# Altium schematic sheet [2]STM32F334R8T6Board_ENC28J60.SchDoc
size B
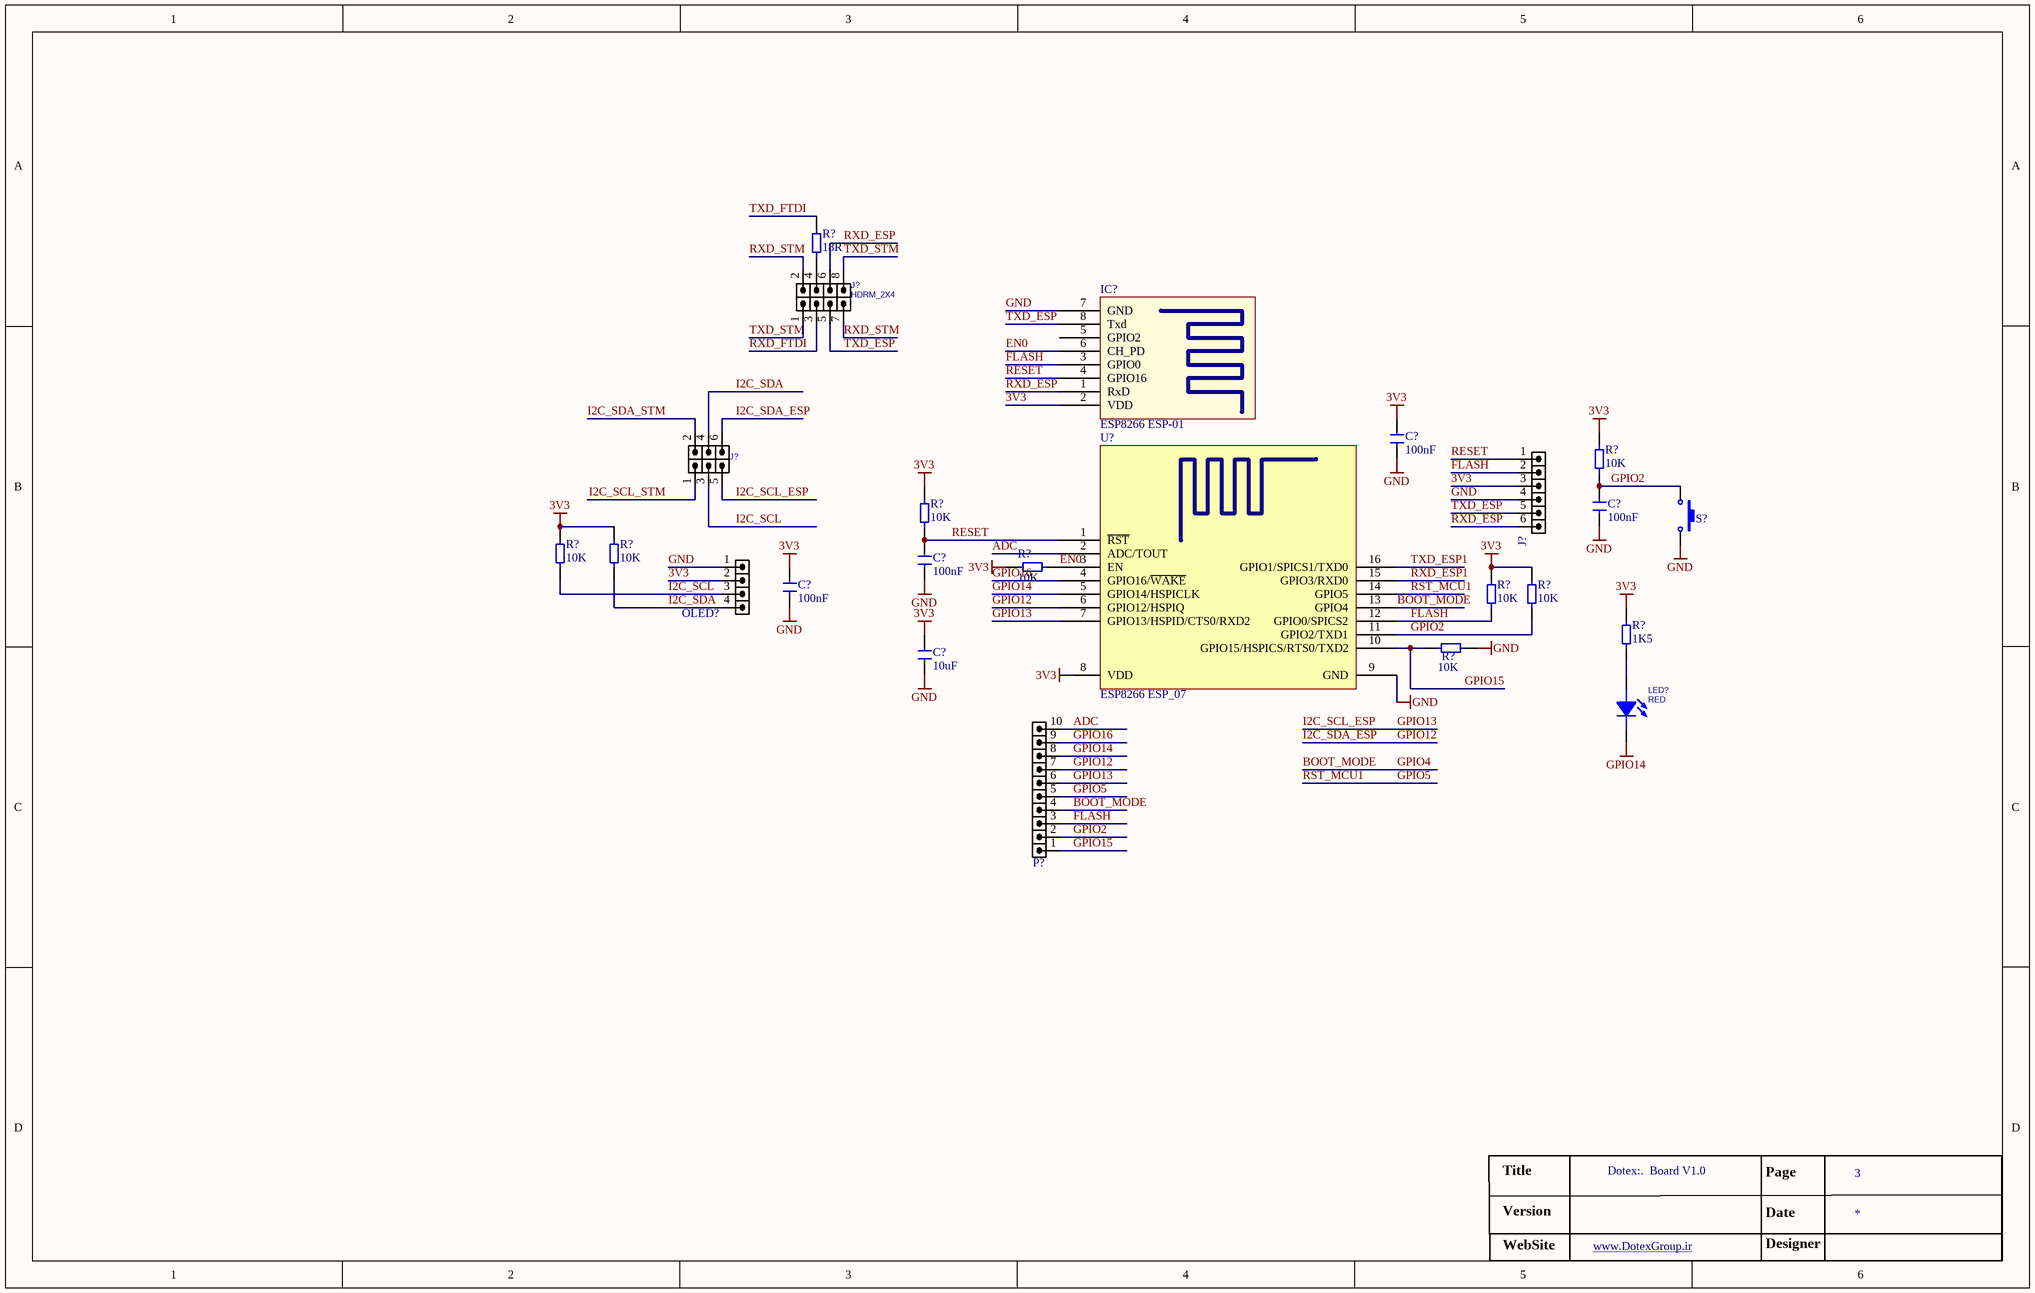
[diagram p0: [2]STM32F334R8T6Board_ENC28J60.SchDoc]

## Parts
(Parts that share a designator on the sheet are numbered #1, #2 ... from top to bottom, then left to right.)
C?#1  Capacitor SMD  [0805 Capacitor]  (value not drawn)
C?#2  Capacitor SMD  [0805 Capacitor]  (value not drawn)
C?#3  Capacitor SMD  [0805 Capacitor]  (value not drawn)
C?#4  Capacitor SMD  [0805 Capacitor]  (value not drawn)
C?#5  Capacitor SMD  [0805 Capacitor]  (value not drawn)
IC?  ESP8266 ESP-01  [HDR_F_2X4]
J?#1  HDRM_2X4  [HDR_M_2X4]
J?#2  HDRM_2X3  [HDR_M_2X3]  (value not drawn)
J?#3  HDR1X6  [HDR_M_1X6]  (value not drawn)
LED?  RED  [LED0805GRN]
OLED?  HDR1X4  [OLED_SSD1306_64_I2C]  (value not drawn)
P?  HDR1X10  [HDR_M_1X10]  (value not drawn)
R?#1  RESISTOR  [RES 0805 (2012X06L)]  (value not drawn)
R?#2  RESISTOR  [RES 0805 (2012X06L)]  (value not drawn)
R?#3  RESISTOR  [RES 0805 (2012X06L)]  (value not drawn)
R?#4  RESISTOR  [RES 0805 (2012X06L)]  (value not drawn)
R?#5  RESISTOR  [RES 0805 (2012X06L)]  (value not drawn)
R?#6  RESISTOR  [RES 0805 (2012X06L)]  (value not drawn)
R?#7  RESISTOR  [RES 0805 (2012X06L)]  (value not drawn)
R?#8  RESISTOR  [RES 0805 (2012X06L)]  (value not drawn)
R?#9  RESISTOR  [RES 0805 (2012X06L)]  (value not drawn)
R?#10  RESISTOR  [RES 0805 (2012X06L)]  (value not drawn)
S?  Switch PB  [SMD_ALPS_SKQMBBE010]  (value not drawn)
U?  ESP8266 ESP_07  [ESP8266 ESP_07]

## Nets
3V3: C?#1.1 C?#4.2 C?#5.2 IC?.2(VDD) J?#3.3 OLED?.2 R?#2.2 R?#3.1 R?#4.1 R?#5.1 R?#6.1 R?#7.2 R?#8.2 R?#9.2 U?.8(VDD)
GND: C?#1.2 C?#2.2 C?#3.1 C?#4.1 C?#5.1 IC?.7(GND) J?#3.4 OLED?.1 R?#10.2 S?.2 U?.9(GND)
GPIO14: LED?.2(CATHODE) P?.8 U?.5(GPIO14/HSPICLK)
ADC: P?.10 U?.2(ADC/TOUT)
BOOT_MODE: P?.4 U?.13(GPIO4)  [also labelled GPIO4]
EN0: IC?.6(CH_PD) R?#6.2 U?.3(EN)
FLASH: IC?.3(GPIO0) J?#3.2 P?.3 R?#7.1 U?.12(GPIO0/SPICS2)
GPIO2: C?#2.1 P?.2 R?#2.1 R?#8.1 S?.1 U?.11(GPIO2/TXD1)
GPIO5: P?.5 U?.14(GPIO5)  [also labelled RST_MCU1]
GPIO12: J?#2.6 P?.7 U?.6(GPIO12/HSPIQ)  [also labelled I2C_SDA_ESP]
GPIO13: J?#2.5 P?.6 U?.7(GPIO13/HSPID/CTS0/RXD2)  [also labelled I2C_SCL_ESP]
GPIO15: P?.1 R?#10.1 U?.10(GPIO15/HSPICS/RTS0/TXD2)
GPIO16: P?.9 U?.4(GPIO16/~{WAKE})
I2C_SCL: J?#2.3 OLED?.3 R?#4.2
I2C_SCL_STM: J?#2.1
I2C_SDA: J?#2.4 OLED?.4 R?#5.2
I2C_SDA_STM: J?#2.2
RESET: C?#3.2 IC?.4(GPIO16) J?#3.1 R?#3.2 U?.1(~{RST})
RXD_ESP: IC?.1(RxD) J?#1.6 J?#3.6
RXD_ESP1: U?.15(GPIO3/RXD0)
RXD_FTDI: J?#1.3
RXD_STM: J?#1.2 J?#1.7
TXD_ESP: IC?.8(Txd) J?#1.5 J?#3.5
TXD_ESP1: U?.16(GPIO1/SPICS1/TXD0)
TXD_FTDI: R?#1.1
TXD_STM: J?#1.1 J?#1.8
NetJ?#1_4: J?#1.4 R?#1.2
NetLED?_1: LED?.1(ANODE) R?#9.1

Not connected (* = marked no-connect by the designer): IC? 5(GPIO2)

## Notes on the sheet
- Title
- Dotex:.  Board V1.0
- Page
- 3
- Version
- Date
- Designer
- WebSite
- www.DotexGroup.ir <http://www.DotexGwww.DotexGroup.irroup.ir>
- Size:
- Date:
- B
- Number:
- Time:
- Revision:
- Sheet
- of
- File:
- (in symbol Capacitor SMD) 100nF; 10uF
- (in symbol Resistor SMD) 10K; 1K5; 18R

## Library data of the parts
J?#1 = HDR_M_2X4: CONN, HEADER, Male, pitch: 2.54mm, 8POS; MANF_P#: MANF_PART#; MANF: MANF; VALUE: HDRM_2X4
J?#2 = HDR_M_2X3: CONN, HEADER, Male, pitch: 2.54mm, 6POS; MANF_P#: MANF_PART#; MANF: MANF; VALUE: HDRM_2X3
J?#3 = HDR_M_1X6: CONN, HEADER, Male, pitch: 2.54mm, 6POS; VALUE: HDRM6
LED? = LED 5MM: Light Emitting Diode; Designer: Abbas Basereh; Data: 16-12-2016; Link: *; Part.No: *
OLED? = HDR_M_1X4: CONN, HEADER, Male, pitch: 2.54mm, 4POS; VALUE: HDRM4
P? = HDR_M_1X10: CONN, HEADER, Male, pitch: 2.54mm, 10POS; VALUE: HDRM10
R?#1-R?#10 = Resistor SMD
S? = Switch PB: Push Button Switch
U? = ESP8266 ESP_12: ESP8266 ESP-12; IC: ESP8266-EX; Vendor: Ai-thinker; LatestReviewer: Zion Blue; Published: 14-Apr-2015; Publisher: Cynetik Group; LatestRevisionData: 14-Apr-2015; LatestRevisionNote: Include 3D body and Footprint